# EAGLE design DigitalSignalGenerator (EAGLE 7.6.0)
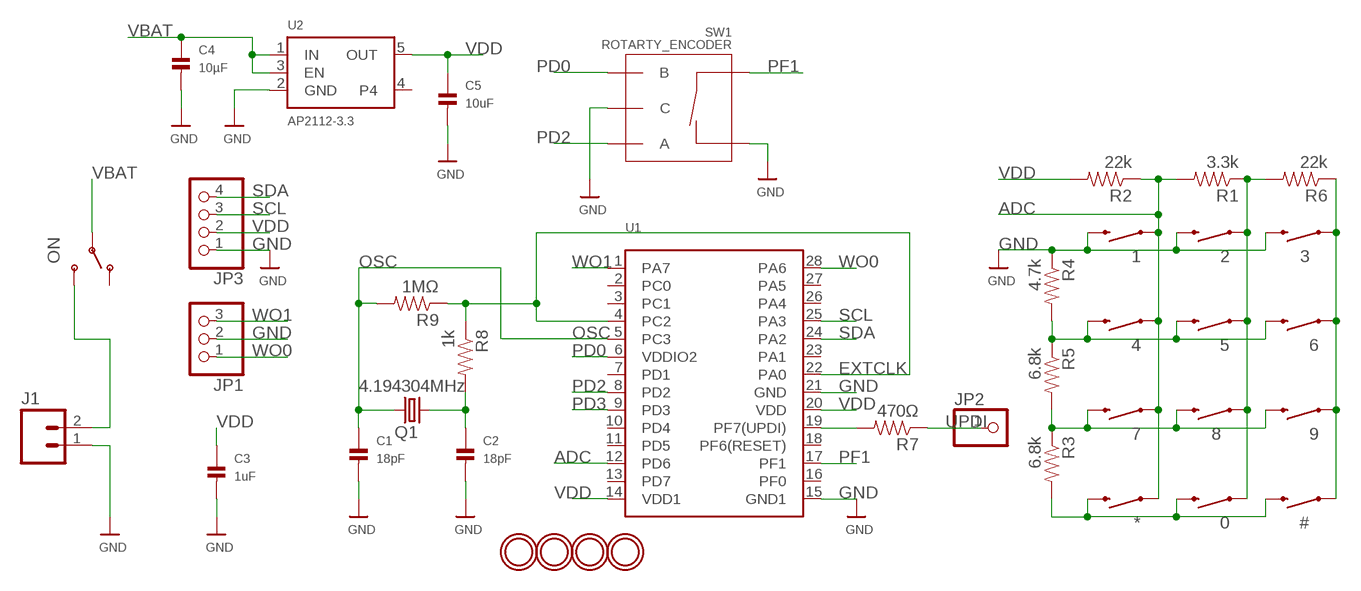
[diagram p0: schematic, sheet 1]

## Parts
0  SWITCH-MOMENTARY-2PTH  [TACTILE-PTH]
1  SWITCH-MOMENTARY-2PTH  [TACTILE-PTH]
2  SWITCH-MOMENTARY-2PTH  [TACTILE-PTH]
3  SWITCH-MOMENTARY-2PTH  [TACTILE-PTH]
4  SWITCH-MOMENTARY-2PTH  [TACTILE-PTH]
5  SWITCH-MOMENTARY-2PTH  [TACTILE-PTH]
6  SWITCH-MOMENTARY-2PTH  [TACTILE-PTH]
7  SWITCH-MOMENTARY-2PTH  [TACTILE-PTH]
8  SWITCH-MOMENTARY-2PTH  [TACTILE-PTH]
9  SWITCH-MOMENTARY-2PTH  [TACTILE-PTH]
#  SWITCH-MOMENTARY-2PTH  [TACTILE-PTH]
*  SWITCH-MOMENTARY-2PTH  [TACTILE-PTH]
C1  18pF  CAP_CERAMIC_0805MP  [_0805MP]
C2  18pF  CAP_CERAMIC_0805MP  [_0805MP]
C3  1uF  CAP_CERAMIC_0805MP  [_0805MP]
C4  10µF  CAP_CERAMIC_0805MP  [_0805MP]
C5  10uF  CAP_CERAMIC_0805MP  [_0805MP]
J1  M02JST-PTH-VERT  [JST-2-PTH-VERT]
JP1  HEADER-1X3ROUND  [1X03_ROUND]
JP2  PINHD-1X1CB  [1X01-CLEANBIG]
JP3  HEADER-1X4ROUND  [1X04_ROUND]
ON  SWITCH-SPDTKIT  [SWITCH-SPDT_KIT]
Q1  4.194304MHz  CSM-7X-DU  [CSM-7X-DU]
R1  3.3k  0.3OHM-1/8W-1%(0805)  [0805]
R2  22k  0.3OHM-1/8W-1%(0805)  [0805]
R3  6.8k  0.3OHM-1/8W-1%(0805)  [0805]
R4  4.7k  0.3OHM-1/8W-1%(0805)  [0805]
R5  6.8k  0.3OHM-1/8W-1%(0805)  [0805]
R6  22k  0.3OHM-1/8W-1%(0805)  [0805]
R7  470Ω  0.3OHM-1/8W-1%(0805)  [0805]
R8  1k  0.3OHM-1/8W-1%(0805)  [0805]
R9  1MΩ  0.3OHM-1/8W-1%(0805)  [0805]
SW1  ROTARTY_ENCODER  [ROTARY_ENC_PLAIN]
U1  AVR64DD28SSOPSSOP28  [SSOP28DB]
U2  AP2112-3.3  VREG_SOT23-5  [SOT23-5]
U$9  MOUNTINGHOLE2.5  [MOUNTINGHOLE_2.5_PLATED]
U$10  MOUNTINGHOLE2.5  [MOUNTINGHOLE_2.5_PLATED]
U$11  MOUNTINGHOLE2.5  [MOUNTINGHOLE_2.5_PLATED]
U$12  MOUNTINGHOLE2.5  [MOUNTINGHOLE_2.5_PLATED]

## Nets
ADC: 1.1 4.1 7.1 *.1 R1.2 R2.1 U1.12(PD6)
EXTCLK: R8.1 R9.1 U1.4(PC2) U1.22(PA0)
GND: 1.3 2.3 3.3 C1.2 C2.2 C3.2 C4.2 C5.2 J1.1 JP1.2 JP3.1 R4.1 SW1.C SW1.SW- U1.15(GND1) U1.21(GND) U2.2(GND)
N$1: R7.2 U1.19(PF7(UPDI))
N$2: C2.1 Q1.2 R8.2
N$3: J1.2 ON.3(S)
N$4: 0.3 #.3 *.3 R3.2
N$6: 4.3 5.3 6.3 R4.2 R5.1
N$7: 7.3 8.3 9.3 R3.1 R5.2
N$12: 0.1 2.1 5.1 8.1 R1.1 R6.2
N$13: 3.1 6.1 9.1 #.1 R6.1
OSC: C1.1 Q1.1 R9.2 U1.5(PC3)
PD0: SW1.B U1.6(VDDIO2)
PD2: SW1.A U1.8(PD2)
PD3: U1.9(PD3)
PF1: SW1.SW+ U1.17(PF1)
SCL: JP3.3 U1.25(PA3)
SDA: JP3.4 U1.24(PA2)
UPDI: JP2.1 R7.1
VBAT: C4.1 ON.2(P) U2.1(IN) U2.3(EN)
VDD: C3.1 C5.1 JP3.2 R2.2 U1.14(VDD1) U1.20(VDD) U2.5(OUT)
WO0: JP1.1 U1.28(PA6)
WO1: JP1.3 U1.1(PA7)
Unconnected: ON.1(O) U1.2(PC0) U1.3(PC1) U1.7(PD1) U1.10(PD4) U1.11(PD5) U1.13(PD7) U1.16(PF0) U1.18(PF6(RESET)) U1.23(PA1) U1.26(PA4) U1.27(PA5) U2.4

## Library data of the parts
0 1-9 # * = SparkFun-Electromechanical:SWITCH-MOMENTARY-2: Various NO switches- pushbuttons, reed, etc; PROD_ID: SWCH-08441
C1-C5 = microbuilder:CAP_CERAMIC: Ceramic Capacitors 0402 - 0402 Surface Mount Capacitors 16pF 50V 5% [Digikey: 445-4899-2-ND] 18pF 50V 5% [Digikey: 490-1281-2-ND] 22pF 50V 5% [Digikey: 490-1283-2-ND] 68pF 50V 5% [Digikey: 490-1289-2-ND] 0.1uF 10V 10% [Digikey: 490-1318-2-ND] 1.0uF 6.3V 10% [Digikey: 490-1320-2-ND] 0603 - 0603 Surface Mount Capacitors 16 pF 50V 5% [Digikey: 445-5051-2-ND] 22 pF 50V [Digikey: PCC220ACVTR-ND] 33 pF 50V 5% [Digikey: 490-1415-1-ND] 56pF 50V 5% [Digikey: 490-1421-1-ND] 220pF 50V 5% [Digikey: 445-1285-1-ND] 680 pF 50V 2200 pF 50V 5% C0G [Digikey: 445-1297-1-ND] 5600 pF 100V 5% X7R [Digikey: 478-3711-1-ND] 0.1 µF 25V 10% [Digikey: PCC2277TR-ND] 0.22 µF 16V 10% X7R [Digikey: 445-1318-1-ND] 1.0 µF 25V 10% [Digikey: 445-5146-2-ND] 0603 - RF Specific 3pF 250V +/-0.1pF RF [Digikey: 712-1347-1-ND] 18 pF 250V 5% [Digikey: 478-3505-1-ND or 712-1322-1-ND] 56 pF 250V 5% C0G RF [Digikey: 490-4867-1-ND] 68 pF 250V RF [Digikey: 490-4868-1-ND] 0805 - 0805 Surface Mount Capacitors 220 pF 250V 2% RF Ceramic Capacitor [Digikey: 712-1398-1-ND] 1000 pF 50V 2% NP0 Ceramic Capacitor [Digikey: 478-3760-1-ND] 0.1 µF 25V 10% Ceramic Capacitor [Digikey: PCC1828TR-ND] 1.0 µF 16V 10% Ceramic Capacitor[Digikey: 490-1691-2-ND] 10.0 µF 10V 10% Ceramic Capacitor[Digikey: 709-1228-1-ND] 10.0 uF 16V 10% Ceramic Capacitor [Digikey: 478-5165-2-ND] 47 uF 6.3V 20% Ceramic Capacitor [Digikey: 587-1779-1-ND or 399-5506-1-ND] 1206 - 1206 Surface Mount Capacitors 47uF 10V 20% Ceramic Capacitor [Digikey: 490-5528-1-ND or 399-5508-1-ND or 445-6010-1-ND] 100uF 6.3V -20%, +80% Y5V Ceramic Capacitor (Digikey: 490-4512-1-ND, Mouser: 81-GRM31CF50J107ZE1L)
J1 = SparkFun-Connectors:M02: Standard 2-pin 0.1" header. Use with - straight break away headers ( PRT-00116) - right angle break away headers (PRT-00553) - swiss pins (PRT-00743) - machine pins (PRT-00117) - female headers (PRT-00115) Molex polarized connector foot print use with: PRT-08233 with associated crimp pins and housings. 2.54_SCREWTERM for use with PRT-10571. 3.5mm Screw Terminal footprints for PRT-08084 5mm Screw Terminal footprints for use with PRT-08432
JP1 = microbuilder:HEADER-1X3: PIN HEADER
JP2 = adafruit:PINHD-1X1: Pin header 1x1 for 0.1" spacing With round pins
JP3 = microbuilder:HEADER-1X4: PIN HEADER
ON = technoblogy:SWITCH-SPDT: SPDT Switch Simple slide switch, Spark Fun Electronics SKU : COM-00102 DPDT SMT slide switch, AYZ0202, SWCH-08179; PROD_ID: SWCH-08261
Q1 = Gaudi:CSM-7X-DU: SMD CRYSTAL Source: www.ecsxtal.com .. Crystal 3.6864MHz CSM_7X_DU.PDF; OC_FARNELL: unknown; OC_NEWARK: unknown
R1-R9 = SparkFun-Resistors:0.3OHM-1/8W-1%(0805): RES-11622; PROD_ID: RES-11622; VALUE: 0.3
SW1 = SparkFun-Electromechanical:ROTARTY_ENCODER: Simple no LED rotary encoder Example: COM-09117
U1 = technoblogy:AVR64DD28SSOP: FTDI FT232RL USB TO RS232 Converter Digikey: 768-1007-1-ND
U2 = microbuilder:VREG_SOT23-5: SOT23-5 Fixed Voltage Regulators Part Current Out V Out V In V Dropout θJA (°C/W) TJ (°C) Digikey Part No. ADP121 150mA 3.3V 3.4-5.5V 0.09V @ 150mA -- -- ADP121-AUJZ33R7CT-ND ADP121 150mA 3.0V 3.1-5.5V 0.09V @ 150mA -- -- ADP121-AUJZ30R7CT-ND ADP122 300mA 3.3V 3.4-5.5V 0.085V @ 300mA -- -- ADP122AUJZ-3.3-R7CT-ND ADP1712 300mA 3.3V 3.5-5.5V 0.17V @ 300mA -- -- ADP1712AUJZ-3.3-R7TR-ND AP7311 (Low Cost) 150mA 3.3V 3.5-6V 0.15V @ 150mA -- -- AP7311-33WG-7DICT-ND LD39015M18R 150mA 1.8V 1.9V-5.5V 0.08V @ 100mA -- -- 497-6977-1-ND LP2985A-33DBVR 150mA 3.3V 3.3-16V 0.28V @ 150mA 206 150 296-18479-1-ND MCP1824T-3302E/OT 300mA 3.3V 3.5V-6V 0.2V @ 300mA -- -- MCP1824T-3302E/OTCT-ND MIC5205-2.5YM5 TR 150mA 2.5V 2.7-16V 0.165V @ 150mA -- -- 576-1257-2-ND MIC5205-3.0YM5 TR 150mA 3.0V 3.2V-16V 0.165V @ 150mA -- -- 576-1258-2-ND MIC5205-3.3YM5 TR 150mA 3.3V 3.5V-16V 0.165V @ 150mA -- -- 576-1259-2-ND TPS780330220 150mA 3.3V+2.2V 3.6-5.5V 250mV Max -- -- 296-23332-1-ND TDA3663/N1,135 100mA 3.3V 3.5-45V 0.18V @ 50mA -- -- 568-5343-1-ND Max operating temp can be calculated using θJA, TJ (max junction temperature), and power in watts. Set the "Maximum Ambient Temperature" until it reaches TJ ("Max Junction Temperature"), which is the absolute limit for safe use of the regulator: Heat Sink Temperature Calculator <http://www.daycounter.com/Calculators/Heat-Sink-Temperature-Calculator.phtml> For example, With 12V source into a 3.3V LP2985 and a 30mA load, we are dissipating (12V-3.3V) * 0.03A = 0.261W. With a θJA of 206 °C/W, a TJ of 150°C, and 261mW we can safely use the chip without a heat sink up to 75°C (=147.1°C Junction Temperature).
U$9-U$12 = microbuilder:MOUNTINGHOLE: Mounting Hole For #2 screws (0.086"/2.18mm width, 0.094"/2.4mm hole) use 2.5mm; BOM: EXCLUDE

## Net classes
1 power: width 1.626 mm, clearance 0.406 mm

## Board
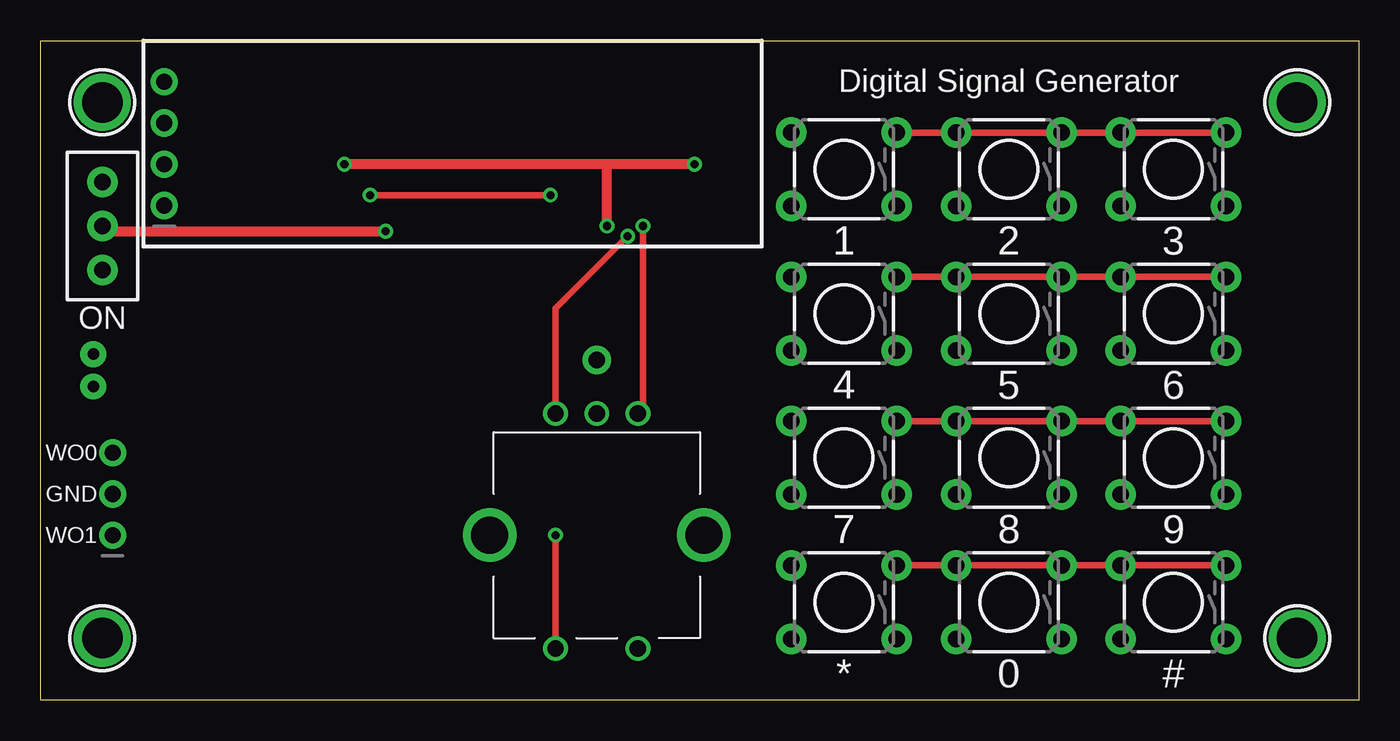
[diagram p1: board, top side]
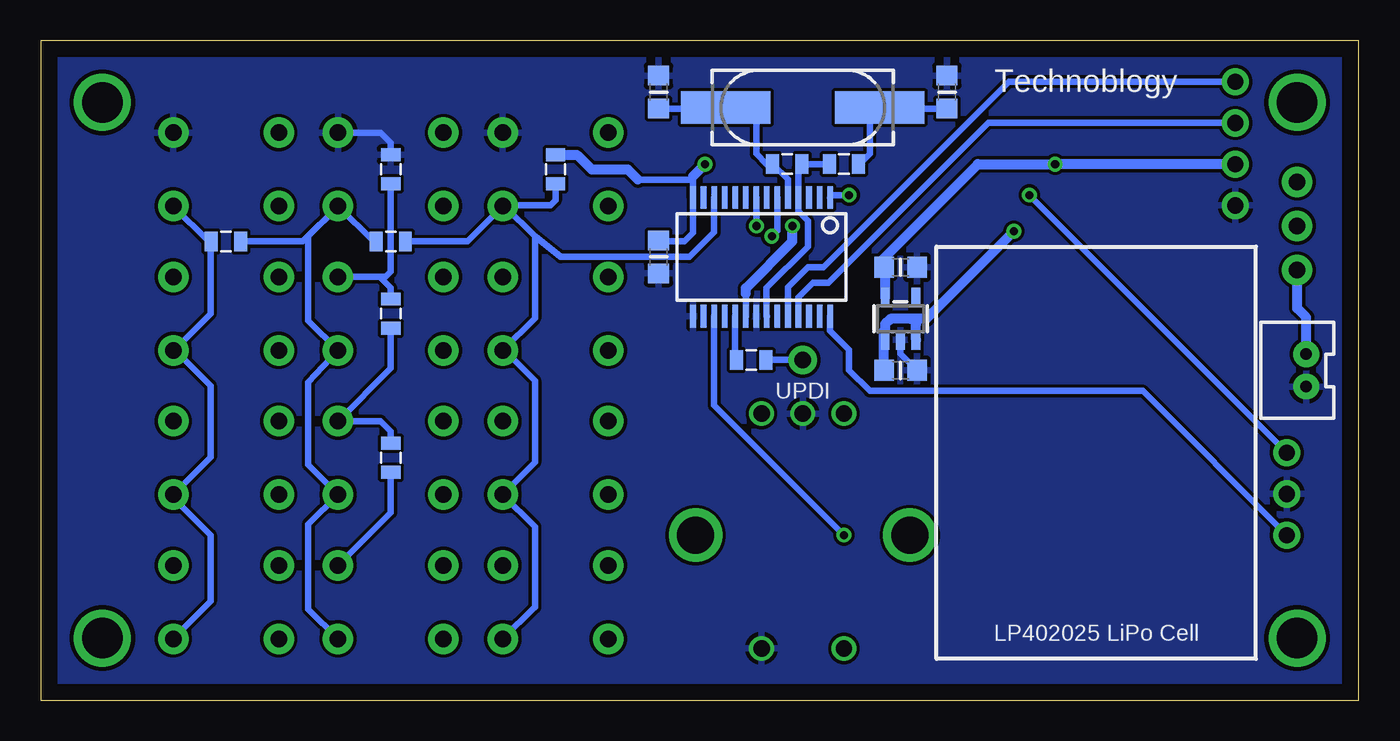
[diagram p2: board, bottom side, seen from below]

Size 81.28 x 40.64 mm. Coordinates in mm from the lower left corner, seen from the top.
Outline: 0,0 0,40.64 81.28,40.64 81.28,0 0,0
Copper layers (1*16): Top 0.035mm / dielectric 1.5mm / Bottom 0.035mm
Design rules "default *": minimum track width 10mil, minimum drill 24mil, track to track 8mil, track to pad 8mil, pad to pad 8mil, via to via 8mil, smd to smd 8mil, copper to edge 40mil, drill to drill 8mil, minimum pad ring 10mil, minimum via ring 8mil, stop-mask expansion 2mil, vias tented up to drill 20mil, thermal gap 10mil

### Footprints (pad centres in the part's own frame; a part is rotated, then mirrored left to right if it is on the bottom)
TACTILE-PTH = drill 1.016 pad 1.88: 1 -3.251,2.261; 2 3.251,2.261; 3 -3.251,-2.261; 4 3.251,-2.261
_0805MP = smd 1.2 x 1.3: 1 -1.016,0; 2 1.016,0
JST-2-PTH-VERT = drill 0.7 pad 1.6: 1 -1,-0.55; 2 1,-0.55
1X03_ROUND = drill 1 pad 1.676: 1 -2.54,0; 2 0,0; 3 2.54,0
1X01-CLEANBIG = drill 1.016 pad 1.778: 1 0,0
1X04_ROUND = drill 1 pad 1.676: 1 -3.81,0; 2 -1.27,0; 3 1.27,0; 4 3.81,0
SWITCH-SPDT_KIT = drill 1.016 pad 1.88: 1 0,2.718; 2 0,0; 3 0,-2.718
CSM-7X-DU = smd 5.5 x 2: 1 -4.75,0; 2 4.75,0
0805 = smd 0.8 x 1.2: 1 -0.9,0; 2 0.9,0
ROTARY_ENC_PLAIN = drill 1.016: A 7.493,-2.54; B 7.493,2.54; C 7.493,0; SW+ -6.985,2.54; SW- -6.985,-2.54 | drill 2.286: P$3 0,6.604; P$4 0,-6.604
SSOP28DB = smd 0.348 x 1.397: 1 -4.225,-3.656; 2 -3.575,-3.656; 3 -2.925,-3.656; 4 -2.275,-3.656; 5 -1.625,-3.656; 6 -0.975,-3.656; 7 -0.325,-3.656; 8 0.325,-3.656; 9 0.975,-3.656; 10 1.625,-3.656; 11 2.275,-3.656; 12 2.925,-3.656; 13 3.575,-3.656; 14 4.225,-3.656; 15 4.225,3.656; 16 3.575,3.656; 17 2.925,3.656; 18 2.275,3.656; 19 1.625,3.656; 20 0.975,3.656; 21 0.325,3.656; 22 -0.325,3.656; 23 -0.975,3.656; 24 -1.625,3.656; 25 -2.275,3.656; 26 -2.925,3.656; 27 -3.575,3.656; 28 -4.225,3.656
SOT23-5 = smd 0.55 x 1.2: 1 -0.95,-1.3; 2 0,-1.3; 3 0.95,-1.3; 4 0.95,1.3; 5 -0.95,1.3
MOUNTINGHOLE_2.5_PLATED = drill 2.5 pad 3.2: P$1 0,0

### Placement (x,y rotation side)
0  59.69,6.03 180 top
1  49.53,32.7 180 top
2  59.69,32.7 180 top
3  69.85,32.7 180 top
4  49.53,23.81 180 top
5  59.69,23.81 180 top
6  69.85,23.81 180 top
7  49.53,14.92 180 top
8  59.69,14.92 180 top
9  69.85,14.92 180 top
#  69.85,6.03 180 top
*  49.53,6.03 180 top
C1  43.18,37.47 90 bottom
C2  25.4,37.47 90 bottom
C3  43.18,27.3 270 bottom
C4  28.26,20.32 0 bottom
C5  28.26,26.67 0 bottom
J1  3.81,20.32 90 bottom
JP1  4.44,12.7 90 top
JP2  34.29,20.95 0 top
JP3  7.62,34.29 90 top
ON  3.81,29.21 0 top
Q1  34.29,36.51 0 bottom
R1  59.69,28.26 0 bottom
R2  49.53,32.7 90 bottom
R3  59.69,14.92 270 bottom
R4  59.69,32.7 270 bottom
R5  59.69,23.81 270 bottom
R6  69.85,28.26 0 bottom
R7  37.47,20.95 180 bottom
R8  31.75,33.02 0 bottom
R9  35.24,33.02 180 bottom
SW1  34.29,10.16 90 top
U1  36.83,27.3 180 bottom
U2  28.26,23.5 0 bottom
U$9  3.81,36.83 0 top
U$10  3.81,3.81 0 top
U$11  77.47,36.83 0 top
U$12  77.47,3.81 0 top

### Tracks (layer width: path | path; a pad name or v marks a point on that pad's centre or on a via)
ADC
  Bottom 0.406: 1.1 54.97,28.26 R1.2 58.74,28.31 | *.1 50.84,5.71 50.8,5.71 50.8,10.68 7.1 50.8,14.64 50.8,19.68 52.67,21.55 4.1 50.8,23.53 50.8,28.57 | 1.1 52.67,30.44 50.8,28.57 | R2.1 49.53,30.8 49.85,30.48 52.74,30.48 1.1 | U1.12 39.76,28.82 41.27,27.3 49.21,27.3 50.8,28.57
EXTCLK
  Bottom 0.406: U1.22 36.51,23.66 36.51,25.4 33.97,27.94 33.97,29.53 34.55,30.11 U1.4 34.55,32.81 R9.1 R8.1
GND
  Top 0.406: 1.3 2.3 3.3
  Bottom 0.406: R4.1 59.69,34.33 60.33,34.96 2.3 | U2.2 28.26,21.34 C4.2 | C5.2 26.99,26.67
  pour Bottom: 0,40.64 0,0 81.28,0 81.28,40.64
N$1
  Bottom 0.406: U1.19 38.45,21.05 R7.2
N$2
  Bottom 0.406: C2.1 27.94,36.45 | 27.94,36.45 28.96,36.45 29.21,36.2 Q1.2 30.16,35.89 30.16,33.66 30.8,33.02 R8.2 | 28.31,36.08 27.94,36.45
N$3
  Bottom 0.61: J1.2 3.26,23.58 3.81,24.13 ON.3
N$4
  Top 0.406: #.3 63.5,8.29 0.3 *.3
  Bottom 0.406: R3.2 59.69,11.54 0.3
N$6
  Top 0.406: 4.3 5.3 6.3
  Bottom 0.406: R5.1 59.69,25.4 60.36,26.07 5.3 60.01,26.07 59.69,26.39 R4.2
N$7
  Top 0.406: 7.3 8.3 9.3
  Bottom 0.406: R5.2 59.69,20.43 8.3 60.33,17.18 59.69,16.55 R3.1
N$12
  Bottom 0.406: 2.1 62.94,30.4 64.77,28.57 64.77,23.38 5.1 64.77,19.57 64.77,14.49 8.1 64.77,10.83 64.77,5.6 0.1 | R6.2 65.13,28.26 2.1 | R1.1 60.76,28.26 2.1
N$13
  Bottom 0.406: 3.1 70.92,28.26 R6.1 70.8,28.2 70.8,23.81 72.99,21.63 72.99,21.55 | 6.1 72.99,21.55 | 72.99,21.55 70.8,19.37 70.8,14.96 9.1 73.1,12.46 70.8,10.16 70.8,6.07 #.1
OSC
  Bottom 0.406: C1.1 39.29,36.45 Q1.1 37.15,36.2 37.15,33.66 36.51,33.02 R9.2 35.2,32.08 U1.5
PD0  (via drill 0.5)
  Top 0.406: SW1.B 31.75,24.13 v36.2,28.57
  Bottom 0.406: U1.6 35.86,28.91 v36.2,28.57
PD2  (via drill 0.5)
  Top 0.406: v37.15,29.21 37.15,18.1 SW1.A
  Bottom 0.406: U1.8 v37.15,29.21
PF1  (via drill 0.5)
  Top 0.406: v31.75,10.16 SW1.SW+
  Bottom 0.406: U1.17 39.76,18.16 v31.75,10.16
SCL
  Bottom 0.406: JP3.3 22.86,35.56 32.7,25.72 33.66,25.72 34.55,24.82 U1.25
SDA
  Bottom 0.406: JP3.4 21.59,38.1 33.02,26.67 33.97,26.67 35.2,25.44 U1.24
UPDI
  Bottom 0.406: R7.1 JP2.1
VBAT  (via drill 0.5)
  Top 0.61: ON.2 4.13,28.89 v21.27,28.89
  Bottom 0.406: 29.27,22.76 U2.1 29.21,22.83 | 27.31,23.18 27.62,23.5
  Bottom 0.61: C4.1 29.27,22.76 | U2.3 27.31,23.18 | 29.21,22.83 29.21,23.18 28.89,23.5 27.62,23.5 26.67,23.5 v21.27,28.89
VDD  (via drill 0.5)
  Top 0.61: v40.32,33.02 34.93,33.02 | 34.93,33.02 v18.73,33.02 | v34.93,29.21 34.93,33.02
  Bottom 0.406: 41.05,32.29 U1.14 41.05,28.8 41.59,28.26 43.12,28.26 C3.1 | U1.20 37.8,25.06 | 44.45,32.07 41.27,32.07 40.96,32.38
  Bottom 0.61: v40.32,33.02 40.96,32.38 41.05,32.29 | JP3.2 v18.73,33.02 23.5,33.02 29.52,26.99 29.52,26.92 C5.1 29.21,26.6 U2.5 | 37.8,25.06 37.8,25.38 34.93,28.26 v34.93,29.21 | R2.2 48.21,33.6 47.31,32.7 45.09,32.7 44.45,32.07
WO0
  Bottom 0.406: JP1.1 13.33,19.05 30.16,19.05 31.43,20.32 31.43,21.59 32.61,22.76 U1.28
WO1  (via drill 0.5)
  Top 0.406: v20.32,31.11 v31.43,31.11
  Bottom 0.406: v31.43,31.11 32.45,31.11 U1.1 | JP1.3 v20.32,31.11

### Text on the board
tPlace: Digital Signal Generator | WO0 | GND | WO1
bPlace: Technoblogy | UPDI | LP402025 LiPo Cell